# EAGLE design Etapa Control (EAGLE 6.3)
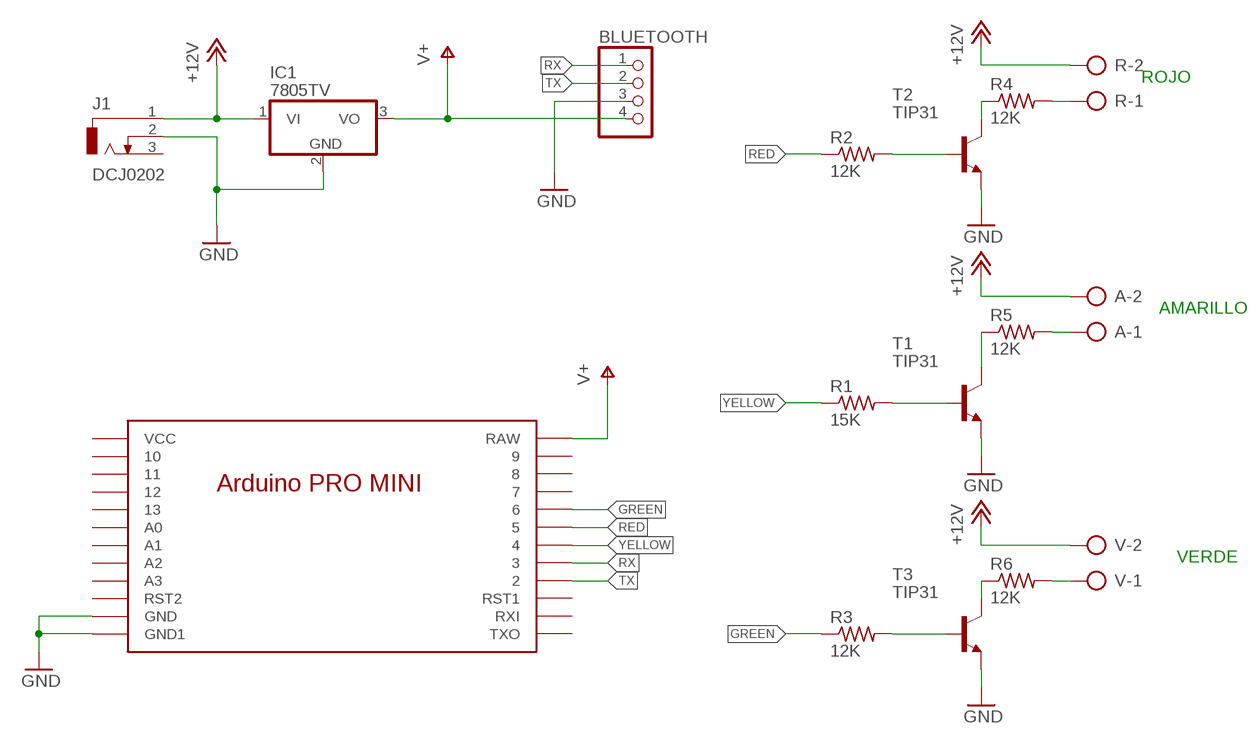
[diagram p0: schematic, sheet 1]

## Parts
A  AK300/2  [AK300/2]
BLUETOOTH  PINHD-1X4  [1X04]
IC1  7805TV  [TO220V]
J1  DCJ0202  [DCJ0202]
R  AK300/2  [AK300/2]
R1  15K  R-US_0204/7  [0204/7]
R2  12K  R-US_0204/7  [0204/7]
R3  12K  R-US_0204/7  [0204/7]
R4  12K  R-US_0204/7  [0204/7]
R5  12K  R-US_0204/7  [0204/7]
R6  12K  R-US_0204/7  [0204/7]
T1  TIP31  [TO220]
T2  TIP31  [TO220]
T3  TIP31  [TO220]
U$1  NANO  [NANO]
V  AK300/2  [AK300/2]

## Nets
+12V: A.2 IC1.1(VI) J1.1 R.2 V.2
GND: BLUETOOTH.3 IC1.2(GND) J1.2 T1.3(E) T2.3(E) T3.3(E) U$1.GND1(GND) U$1.GND2(GND1)
GREEN: R3.1 U$1.6
N$1: R1.2 T1.1(B)
N$2: R2.2 T2.1(B)
N$3: R3.2 T3.1(B)
N$4: R6.1 T3.2(C)
N$5: R4.1 T2.2(C)
N$6: R5.1 T1.2(C)
N$7: R4.2 R.1
N$8: A.1 R5.2
N$9: R6.2 V.1
RED: R2.1 U$1.5
RX: BLUETOOTH.1 U$1.3
TX: BLUETOOTH.2 U$1.2
V+: BLUETOOTH.4 IC1.3(VO) U$1.RAW
YELLOW: R1.1 U$1.4
Unconnected: J1.3 U$1.7 U$1.8 U$1.9 U$1.10 U$1.11 U$1.12 U$1.13 U$1.A0 U$1.A1 U$1.A2 U$1.A3 U$1.RST1 U$1.RST2 U$1.RXI U$1.TXO U$1.VCC

## Notes on the sheet
- ROJO
- AMARILLO
- VERDE

## Library data of the parts
A R V = con-ptr500:AK300/2: CONNECTOR; OC_FARNELL: unknown; OC_NEWARK: unknown
BLUETOOTH = pinhead:PINHD-1X4: PIN HEADER
IC1 = linear:78*: Positive VOLTAGE REGULATOR Source: http://cache.national.com/ds/LM/LM78L05.pdf http://www.fairchildsemi.com/ds/LM/LM7805.pdf
J1 = con-jack:DCJ0202: DC POWER JACK Source: DCJ0202.pdf; OC_FARNELL: unknown; OC_NEWARK: unknown
R1-R6 = resistor:R-US_: RESISTOR, American symbol
T1-T3 = transistor:TIP31: NPN Transistor Medium Power Linear Switching Applications Source: http://onsemi.com
U$1 = E-Lab:NANO

## Board
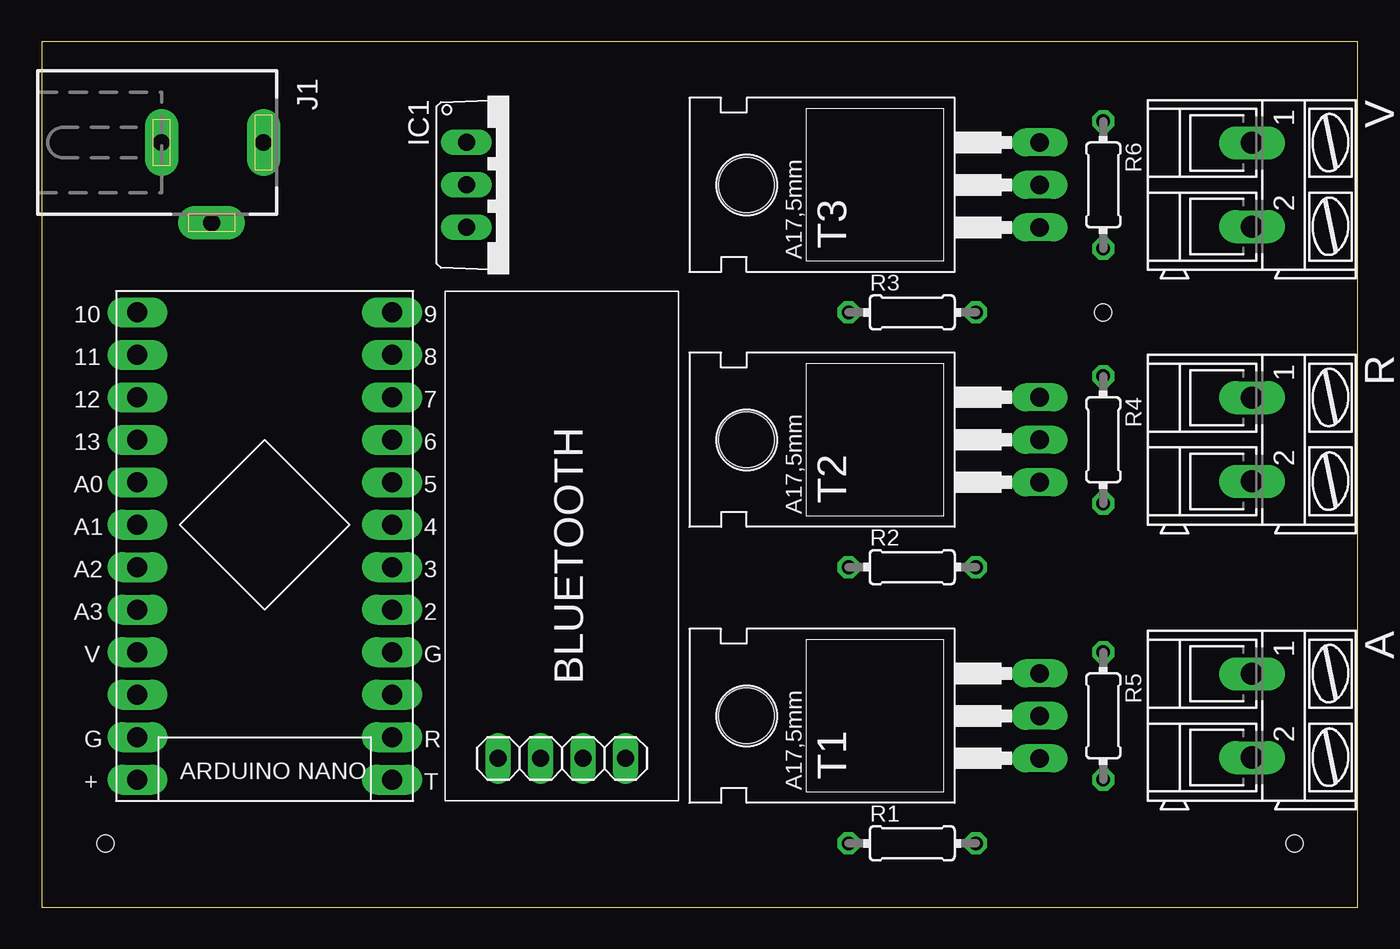
[diagram p1: board, top side]
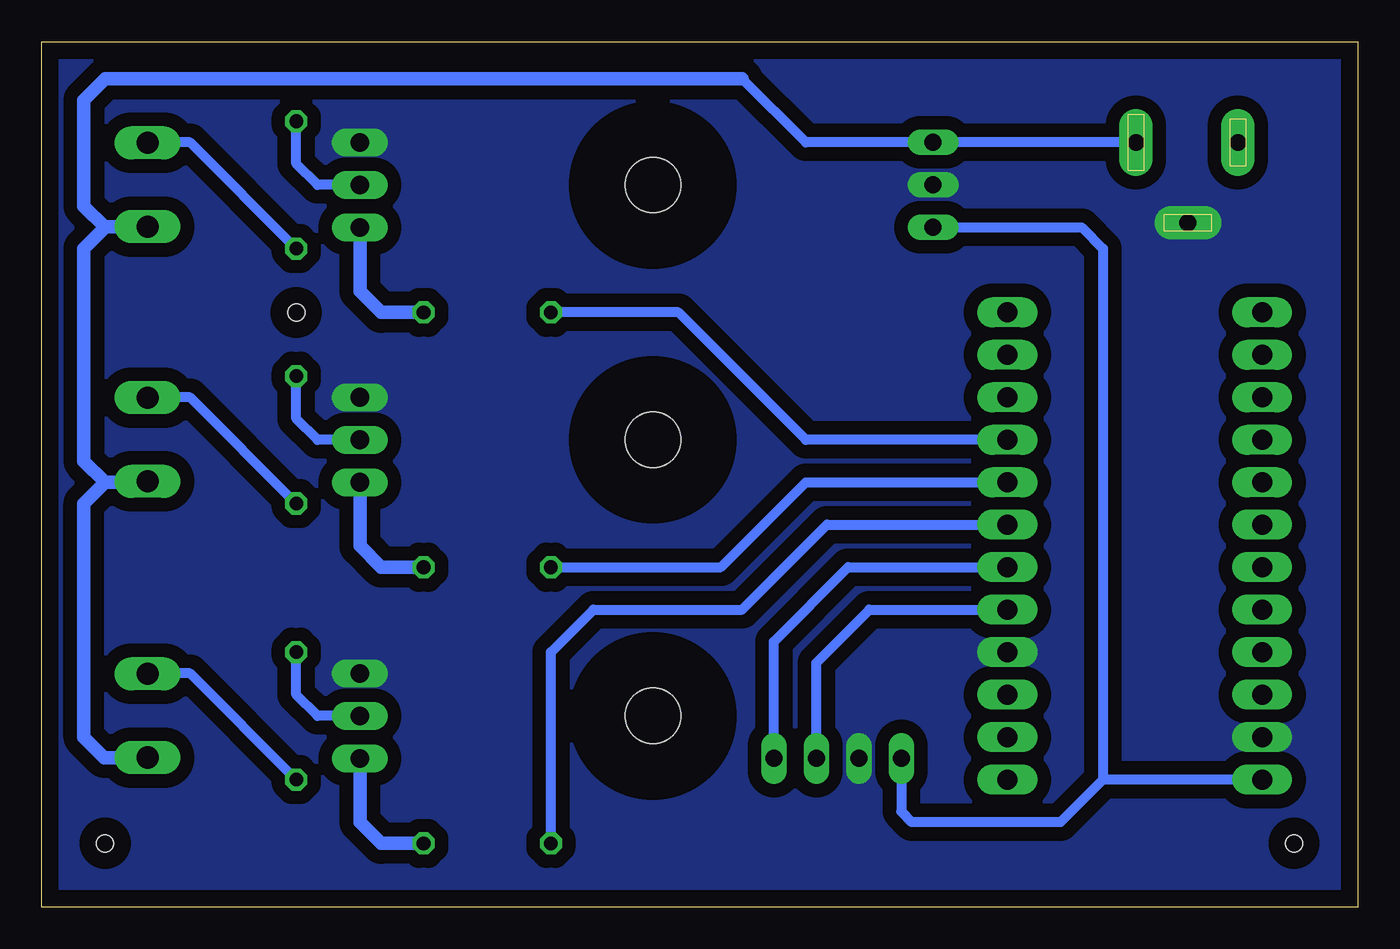
[diagram p2: board, bottom side, seen from below]

Size 78.72 x 51.74 mm. Coordinates in mm from the lower left corner, seen from the top.
Outline: 0,0 78.72,0 78.72,51.74 0,51.74 0,0
Copper layers (1*16): Top 0.035mm / dielectric 1.5mm / Bottom 0.035mm
Design rules "default": minimum track width 10mil, minimum drill 24mil, track to track 8mil, track to pad 8mil, pad to pad 8mil, via to via 8mil, smd to smd 8mil, copper to edge 40mil, drill to drill 8mil, minimum pad ring 10mil, minimum via ring 8mil, stop-mask expansion 4mil, vias tented up to drill 0mil, thermal gap 10mil
Holes 1 mm at 3.81,3.81 74.93,3.81 63.5,35.56

### Footprints (pad centres in the part's own frame; a part is rotated, then mirrored left to right if it is on the bottom)
AK300/2 = drill 1.321 long: 1 -2.515,0; 2 2.489,0
1X04 = drill 1.016 long: 1 -3.81,0; 2 -1.27,0; 3 1.27,0; 4 3.81,0
TO220V = drill 1.016 long: 1 -2.54,-2.54; 2 0,-2.54; 3 2.54,-2.54
DCJ0202 = drill 1 pad 2 long: 1 0,3.1; 2 4.8,0; 3 0,-3
0204/7 = drill 0.813 octagon: 1 -3.81,0; 2 3.81,0
TO220 = drill 1.118 long: 1 -2.54,-6.35; 2 0,-6.35; 3 2.54,-6.35 | hole 3.302: 0,11.176
NANO = drill 1.2 long: 2 7.62,-5.08; 3 7.62,-2.54; 4 7.62,0; 5 7.62,2.54; 6 7.62,5.08; 7 7.62,7.62; 8 7.62,10.16; 9 7.62,12.7; 10 -7.62,12.7; 11 -7.62,10.16; 12 -7.62,7.62; 13 -7.62,5.08; A0 -7.62,2.54; A1 -7.62,0; A2 -7.62,-2.54; A3 -7.62,-5.08; GND1 -7.62,-12.7; GND2 7.62,-7.62; RAW -7.62,-15.24; RST1 -7.62,-10.16; RST2 7.62,-10.16; RXI 7.62,-12.7; TXO 7.62,-15.24; VCC -7.62,-7.62

### Placement (x,y rotation side)
A  72.39,11.43 270 top
BLUETOOTH  31.11,8.89 180 top
IC1  27.94,43.18 270 top
J1  10.16,45.72 270 top
R  72.39,27.94 270 top
R1  52.07,3.81 0 top
R2  52.07,20.32 0 top
R3  52.07,35.56 0 top
R4  63.5,27.94 270 top
R5  63.5,11.43 270 top
R6  63.5,43.18 270 top
T1  53.34,11.43 90 top
T2  53.34,27.94 90 top
T3  53.34,43.18 90 top
U$1  13.33,22.86 0 top
V  72.39,43.18 270 top

### Tracks (layer width: path | path; a pad name or v marks a point on that pad's centre or on a via)
+12V
  Bottom 0.61: J1.1 IC1.1 33.02,45.72 36.83,49.53
  Bottom 0.813: V.2 74.88,40.69 74.93,40.64 | 74.93,40.64 76.2,39.37 76.2,26.67 74.93,25.4 | R.2 72.44,25.4 74.93,25.4 | A.2 74.98,8.94 76.2,10.16 76.2,24.13 74.93,25.4 | 74.93,40.64 76.2,41.91 76.2,48.26 74.93,49.53 36.83,49.53
GND
  pour Bottom (isolate 0.813, no thermals): 0,0 0,52.07 78.74,52.07 78.74,0
GREEN
  Bottom 0.61: U$1.6 33.02,27.94 40.64,35.56 R3.1
N$1
  Bottom 0.813: R1.2 58.42,3.81 59.69,5.08 T1.1
N$2
  Bottom 0.813: R2.2 58.42,20.32 59.69,21.59 T2.1
N$3
  Bottom 0.813: R3.2 58.42,35.56 59.69,36.83 T3.1
N$4
  Bottom 0.61: T3.2 62.23,43.18 63.5,44.45 R6.1
N$5
  Bottom 0.61: T2.2 62.23,27.94 63.5,29.21 R4.1
N$6
  Bottom 0.61: T1.2 62.23,11.43 63.5,12.7 R5.1
N$7
  Bottom 0.61: R4.2 69.85,30.48 72.36,30.48 R.1
N$8
  Bottom 0.61: R5.2 69.85,13.97 72.36,13.97 A.1
N$9
  Bottom 0.61: R6.2 69.85,45.72 72.36,45.72 V.1
RED
  Bottom 0.61: R2.1 38.1,20.32 33.02,25.4 U$1.5
RX
  Bottom 0.61: U$1.3 30.48,20.32 34.93,15.88 BLUETOOTH.1
TX
  Bottom 0.61: U$1.2 29.21,17.78 32.38,14.61 BLUETOOTH.2
V+
  Bottom 0.61: U$1.RAW 15.24,7.62 | 15.24,7.62 17.78,5.08 26.67,5.08 27.3,5.71 BLUETOOTH.4 | IC1.3 16.51,40.64 15.24,39.37 15.24,7.62
YELLOW
  Bottom 0.61: R1.1 48.26,15.24 45.72,17.78 36.83,17.78 31.75,22.86 U$1.4

### Text on the board
tNames: BLUETOOTH
Etiquetas: TIP31 | Verde | TIP31 | Rojo | TIP31 | Amarillo